# EAGLE design LooUQ CircuitRiver - Feather-630 Spring (EAGLE 7.5.0)
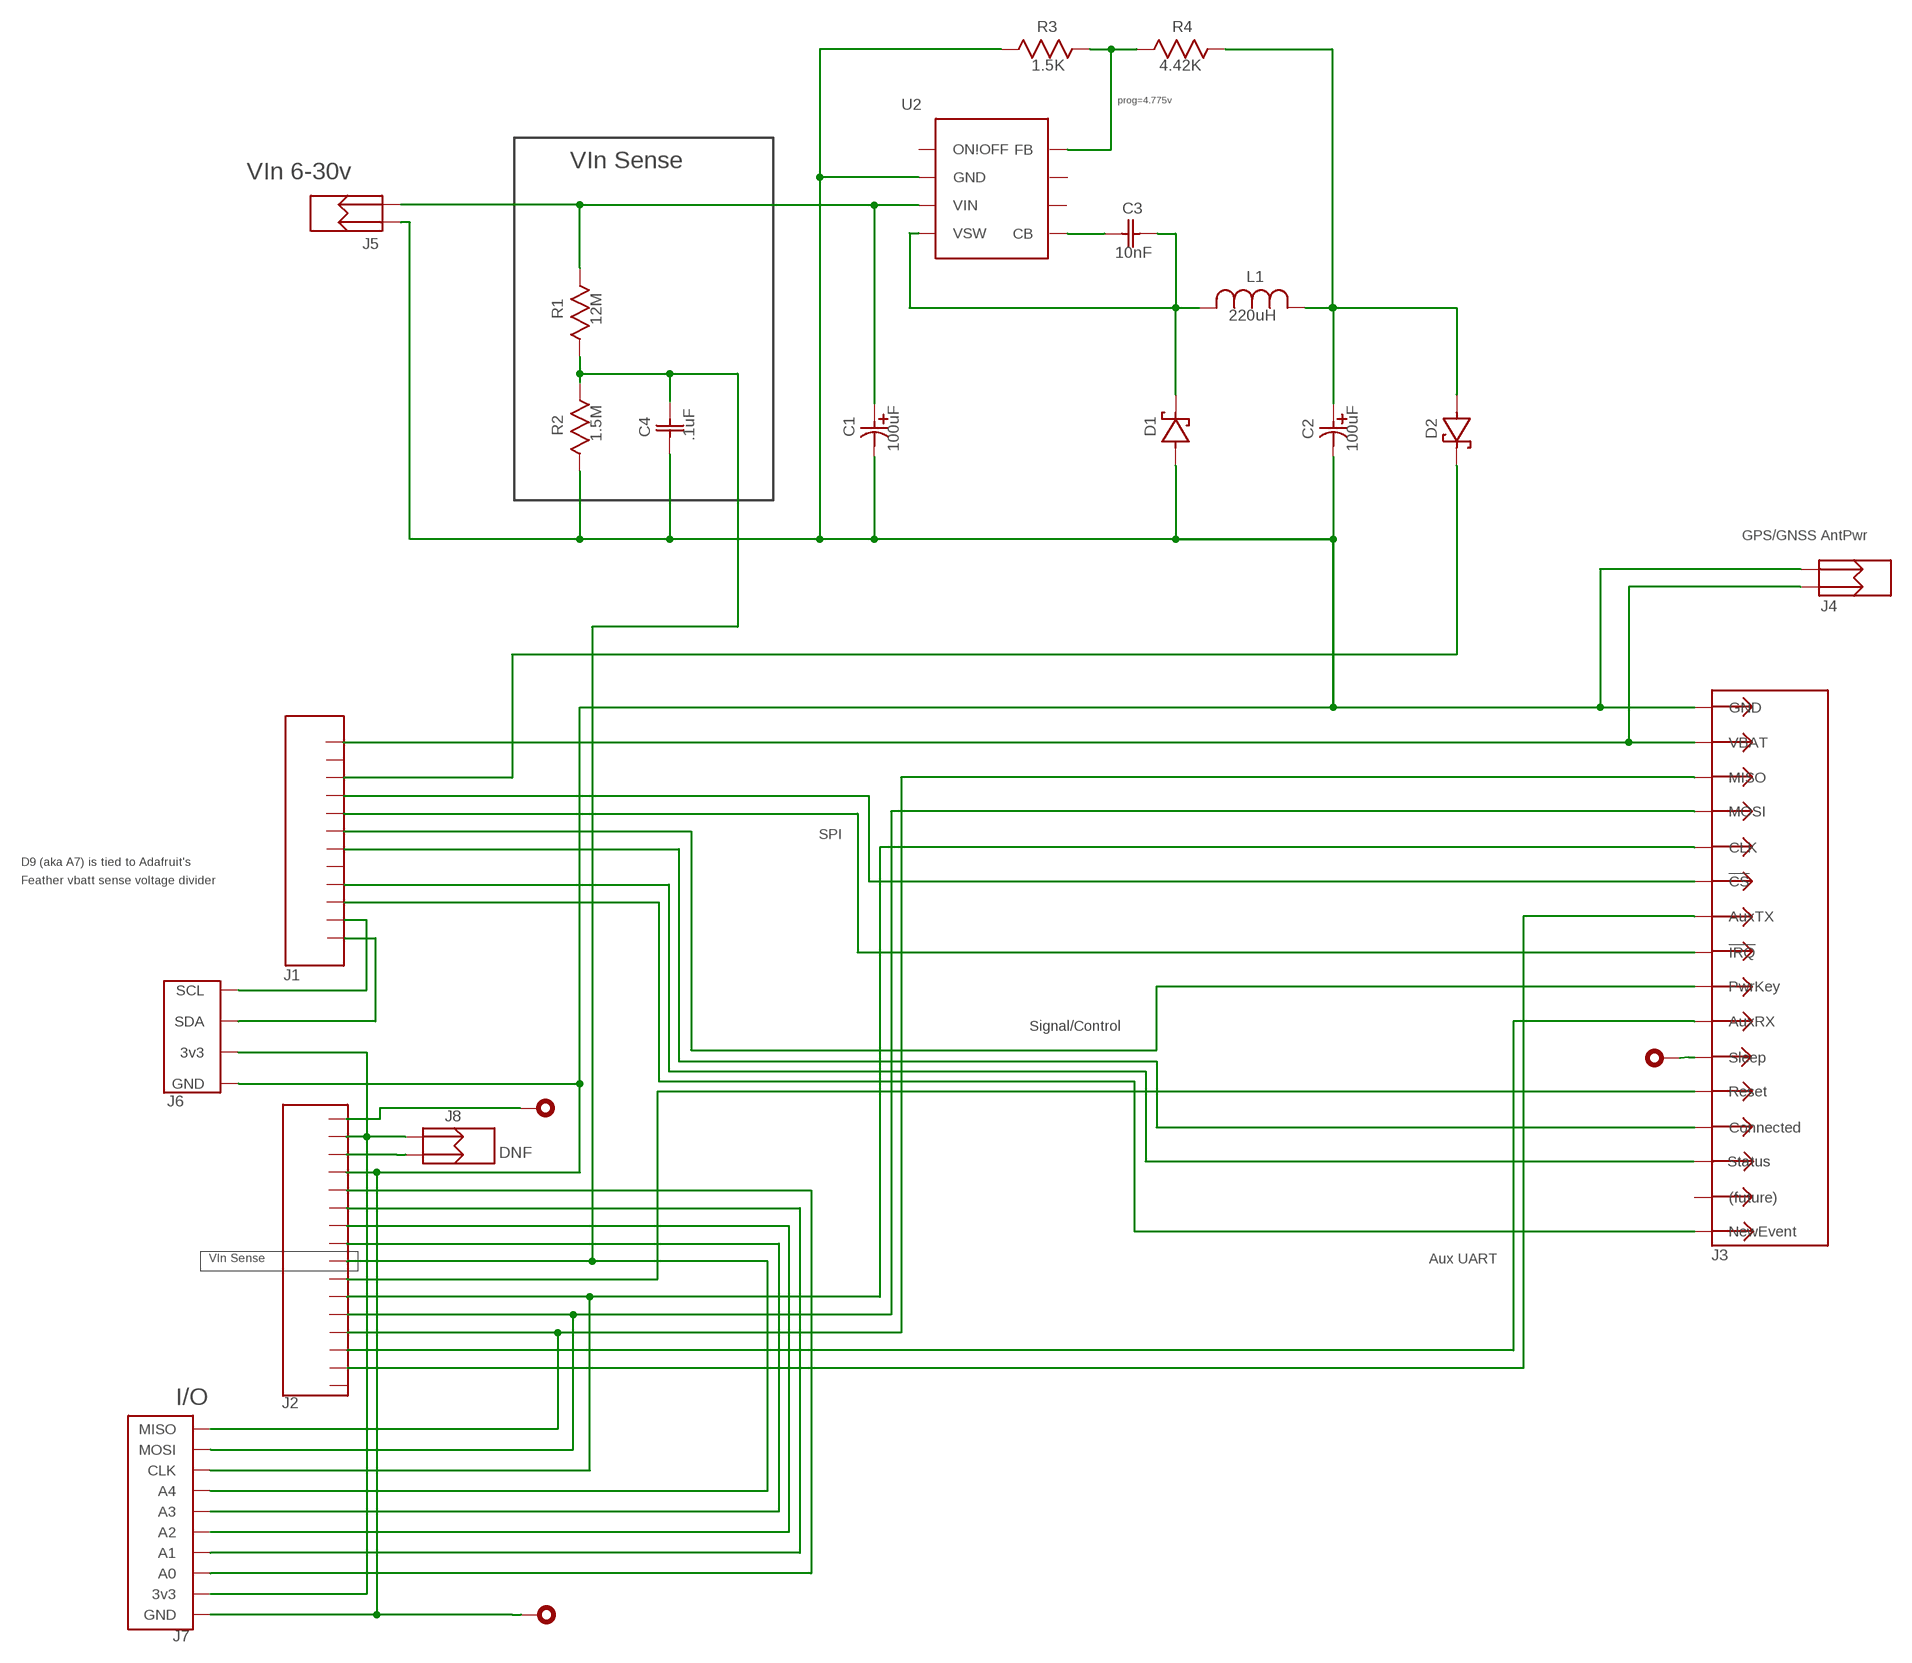
[diagram p0: schematic, sheet 1]

## Parts
C1  100uF  DEV_C1  [TC_2917]
C2  100uF  DEV_C2  [TC_2917]
C3  10nF  CAP_0603_NP  [CAP_0603]
C4  .1uF  CAP_0603_NP  [CAP_0603]
D1  1N5819HW  [SOD-123]
D2  1N5819HW  [SOD-123]
J1  FEATHERHOST-S  [HDR-1x12T/2.54/30x2]
J2  FEATHERHOST-L  [HDR-1x16T/2.54/40x2]
J3  CR-SPRING_HEADER  [HDR-2x8T/2x2/16x4]
J4  JST_PH-2_R/A_T/H  [JST_PH-2_R/A_T/H]
J5  JST_PH-2_VERT_T/H  [JST_PH-2_VERT_T/H]
J6  QWIIC_VERTICAL  [JST_SH-04_VERT_SMD_Qwiic]
J7  CR-RAPIDSIO_VERTICAL  [JST-SH_SMD-TopEntry_Rapids]
J8  DNF  2PIN_T/H_HEADER  [HDR-1x2T/2/4x2]
L1  220uH  INDUCTOR_-_BOURNS_SRR1260  [Bourns_SRR1260_Series]
LG1  DNF  LOOUQ_LOGO  [LooUQ-6mm]
LG2  DNF  CIRCUITRIVER_LOGO  [CircuitRiver-6mm]
P1  DNF  BREAKOUTPAD  [BreakoutConn]
P2  DNF  BREAKOUTPAD  [BreakoutConn]
P3  DNF  BREAKOUTPAD  [BreakoutConn]
R1  12M  RES_0603  [RES_0603]
R2  1.5M  RES_0603  [RES_0603]
R3  1.5K  1%_VPROG  [RES_0603]
R4  4.42K  1%_VPROG  [RES_0603]
U2  LM2674_BUCK  [SOIC-8/150mil]

## Nets
Net_1: J1.4(D13) J3.6(!CS)
Net_2: J2.4(MISO) J3.3(MISO) J7.10(MISO)
Net_3v3 [Power]: J2.15(+3V3) J6.2(3v3) J7.2(3v3) J8.2
Net_4: J1.6(D11) J3.9(PwrKey)
Net_5: J2.7(A5) J3.12(Reset)
Net_6: J2.6(SCK) J3.5(CLK) J7.8(CLK)
Net_7: J2.3(D0) J3.10(AuxRX)
Net_8: J2.5(MOSI) J3.4(MOSI) J7.9(MOSI)
Net_9: J1.7(D10) J3.13(Connected)
Net_10: R3.2 R4.1 U2.4(FB)
Net_11: J2.12(A0) J7.3(A0)
Net_12: J1.9(D6) J3.14(Status)
Net_14: J1.5(D12) J3.8(!IRQ)
Net_15: J2.10(A2) J7.5(A2)
Net_16: C3.1 U2.1(CB)
Net_18: C4.1 J2.8(A4) J7.7(A4) R1.1 R2.1
Net_19: J2.2(D1) J3.7(AuxTX)
Net_21 [Power]: C2.1(PLUS) D2.2(A) L1.2 R4.2
Net_22: J3.11(Sleep) P3.1
Net_23: J2.9(A3) J7.6(A3)
Net_25: J2.11(A1) J7.4(A1)
Net_26: J1.10(D5) J3.16(NewEvent)
Net_27: J1.12(SDA) J6.3(SDA)
Net_28: J1.11(SCI) J6.4(SCL)
Net_29: J2.14(AREF) J8.1
Net_30: J2.16(!RESET) P1.1
Net_GND [Power]: C1.2(MINUS) C2.2(MINUS) C4.2 D1.2(A) J2.13(GND) J3.1(GND) J4.2 J5.2 J6.1(GND) J7.1(GND) P2.1 R2.2 R3.1 U2.6(GND)
Net_VBAT [Power]: J1.1(VBAT) J3.2(VBAT) J4.1
Net_VBUS [Power]: D2.1(C) J1.3(VBUS)
Net_VIn [Power]: C1.1(PLUS) J5.1 R1.2 U2.7(VIN)
Net_VSW [Power]: C3.2 D1.1(C) L1.1 U2.8(VSW)
Unconnected: J1.2(EN) J1.8(D9) J2.1(GND) J3.15((future)) U2.2(NC) U2.3(NC) U2.5(ON\!OFF)

## Notes on the sheet
- prog=4.775v
- VIn Sense
- VIn 6-30v
- GPS/GNSS AntPwr
- SPI
- D9 (aka A7) is tied to Adafruit's
- Feather vbatt sense voltage divider
- Signal/Control
- VIn Sense | Aux UART
- I/O

## Library data of the parts
C1 = common:DEV_C1; MANUFACTURER: Kemet; MFGPARTNM: T491X107K025AT
C2 = common:DEV_C2; MANUFACTURER: Kemet; MFGPARTNM: T491X107K025AT
C3 = common:CAP_0603_NP; MANUFACTURER: AVX; MFGPARTNM: 06035C103KAT2A
C4 = common:CAP_0603_NP; MANUFACTURER: AVX; MFGPARTNM: 06035C103KAT2A; VALUE: 10nF
D1 D2 = common:1N5819HW; DATASHEET: http://datasheets.diptrace.com/diodes/ds30217.pdf; MANUFACTURER: Diodes; MFGPARTNM: 1N5819HW-7-F
J1 = common:FEATHERHOST-S; DATASHEET: https://drawings-pdf.s3.amazonaws.com/10492.pdf; DESCRIPTION: CONN HDR 12POS 0.1 TIN PCB; MANUFACTURER: Sullins; MFGPARTNM: PPTC121LFBN-RC
J2 = common:FEATHERHOST-L; DATASHEET: https://drawings-pdf.s3.amazonaws.com/10492.pdf; DESCRIPTION: CONN HDR 16POS 0.1 TIN PCB; MANUFACTURER: Sullins; MFGPARTNM: PPTC161LFBN-RC
J3 = common:CR-SPRING_HEADER; DATASHEET: https://cdn.harwin.com/pdfs/M22-204.pdf; MANUFACTURER: Harwin; MFGPARTNM: M22-2040805
J4 = common:JST_PH-2_R/A_T/H; DATASHEET: http://www.jst-mfg.com/product/pdf/eng/ePH.pdf; DESCRIPTION: CONN HEADER R/A 2POS 2MM; MANUFACTURER: JST; MFGPARTNM: S2B-PH-K-S(LF)(SN)
J5 = common:JST_PH-2_VERT_T/H; DATASHEET: http://www.jst-mfg.com/product/pdf/eng/ePH.pdf; DESCRIPTION: CONN HEADER R/A 2POS 2MM; MANUFACTURER: JST; MFGPARTNM: B2B-PH-K-S(LF)(SN)
J6 = common:QWIIC_VERTICAL; DESCRIPTION: CONN HEADER SMD 4POS 1MM; MANUFACTURER: JST; MFGPARTNM: BM04B-SRSS-TB(LF)(SN)
J7 = common:CR-RAPIDSIO_VERTICAL; DATASHEET: http://www.jst-mfg.com/product/pdf/eng/eSH.pdf; DESCRIPTION: CONN HEADER SMD 10POS 1MM; MANUFACTURER: JST; MFGPARTNM: BM10B-SRSS-TB(LF)(SN)
J8 = common:2PIN_T/H_HEADER; DATASHEET: https://media.digikey.com/pdf/Data%20Sheets/3M%20PDFs/951yyy-xx22-AR_Series%20Datasheet.pdf; MANUFACTURER: 3M; MFGPARTNM: 951102-8622-AR
L1 = common:INDUCTOR_-_BOURNS_SRR1260; DATASHEET: https://www.bourns.com/docs/Product-Datasheets/SRR1260.pdf; MANUFACTURER: Bourns; MFGPARTNM: SRR1260-221K
LG1 = common:LOOUQ_LOGO
LG2 = common:CIRCUITRIVER_LOGO
P1-P3 = common:BREAKOUTPAD
R1 = common:RES_0603; DESCRIPTION: RES 12M OHM 5% 1/10W 0603; MANUFACTURER: Stackpole; MFGPARTNM: RMCF0603JT12M0
R2 = common:RES_0603; DESCRIPTION: RES 12M OHM 5% 1/10W 0603; MANUFACTURER: Stackpole; MFGPARTNM: RMCF0603JT12M0; VALUE: 12M
R3 = common:1%_VPROG; DESCRIPTION: RES SMD 1.5K OHM 1% 1/20W 0201; MANUFACTURER: Yageo; MFGPARTNM: RC0201FR-071K5L
R4 = common:1%_VPROG; DESCRIPTION: RES SMD 1.5K OHM 1% 1/20W 0201; MANUFACTURER: Yageo; MFGPARTNM: RC0201FR-071K5L; VALUE: 1.5K
U2 = common:LM2674_BUCK; DESCRIPTION: IC REG BUCK 5V 0.5A 8SOIC; MANUFACTURER: TI; MFGPARTNM: LM2674MX-ADJ/NOPB

## Net classes
1 Power: width 0.5 mm, clearance 0.2 mm

## Board
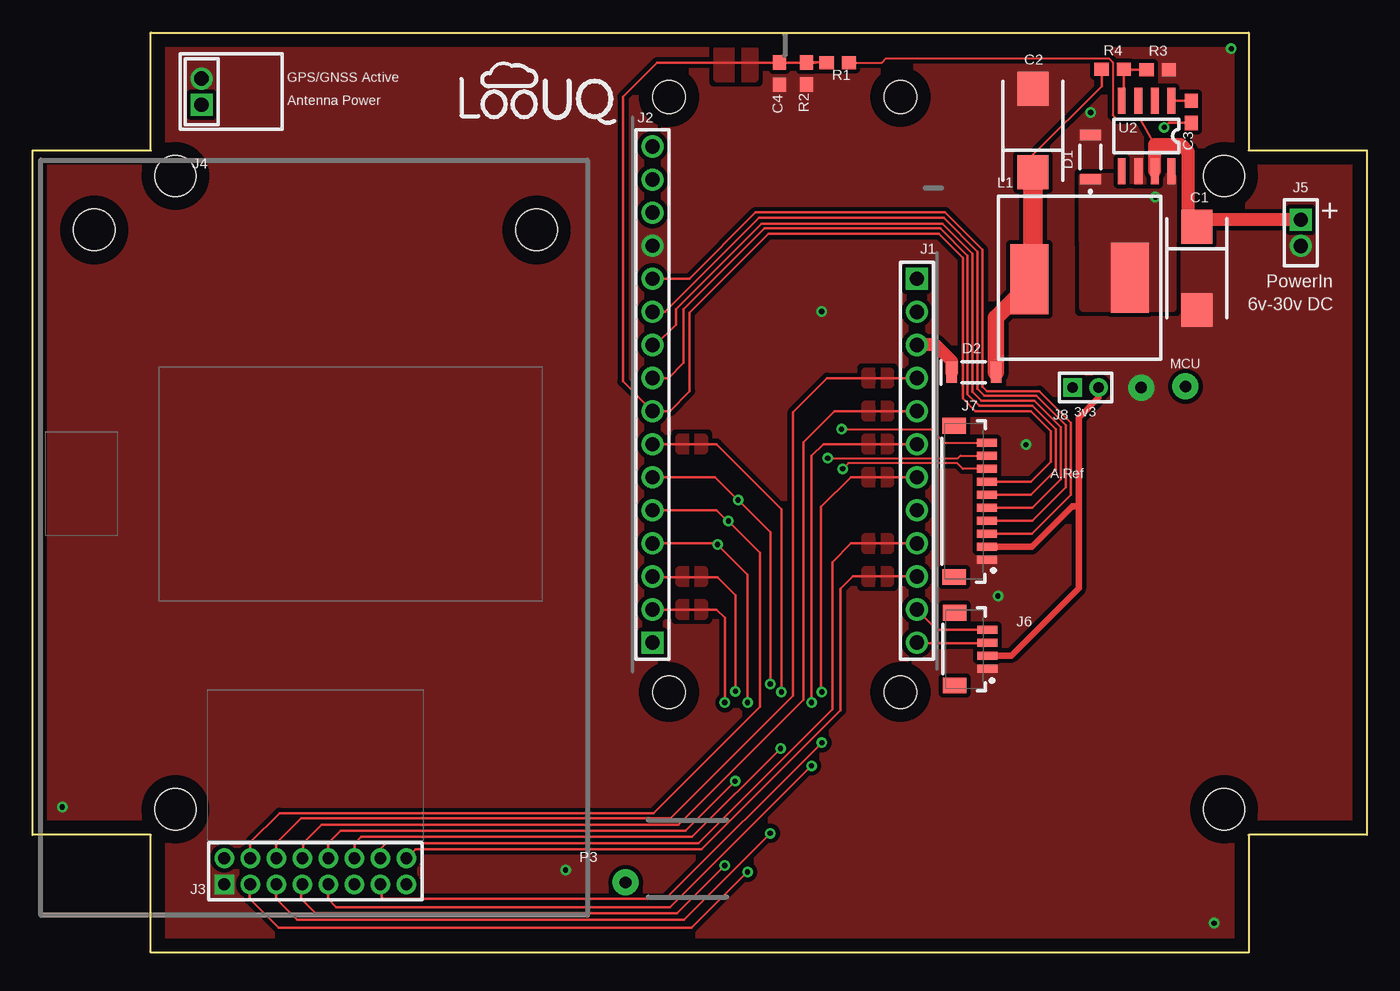
[diagram p1: board, top side]
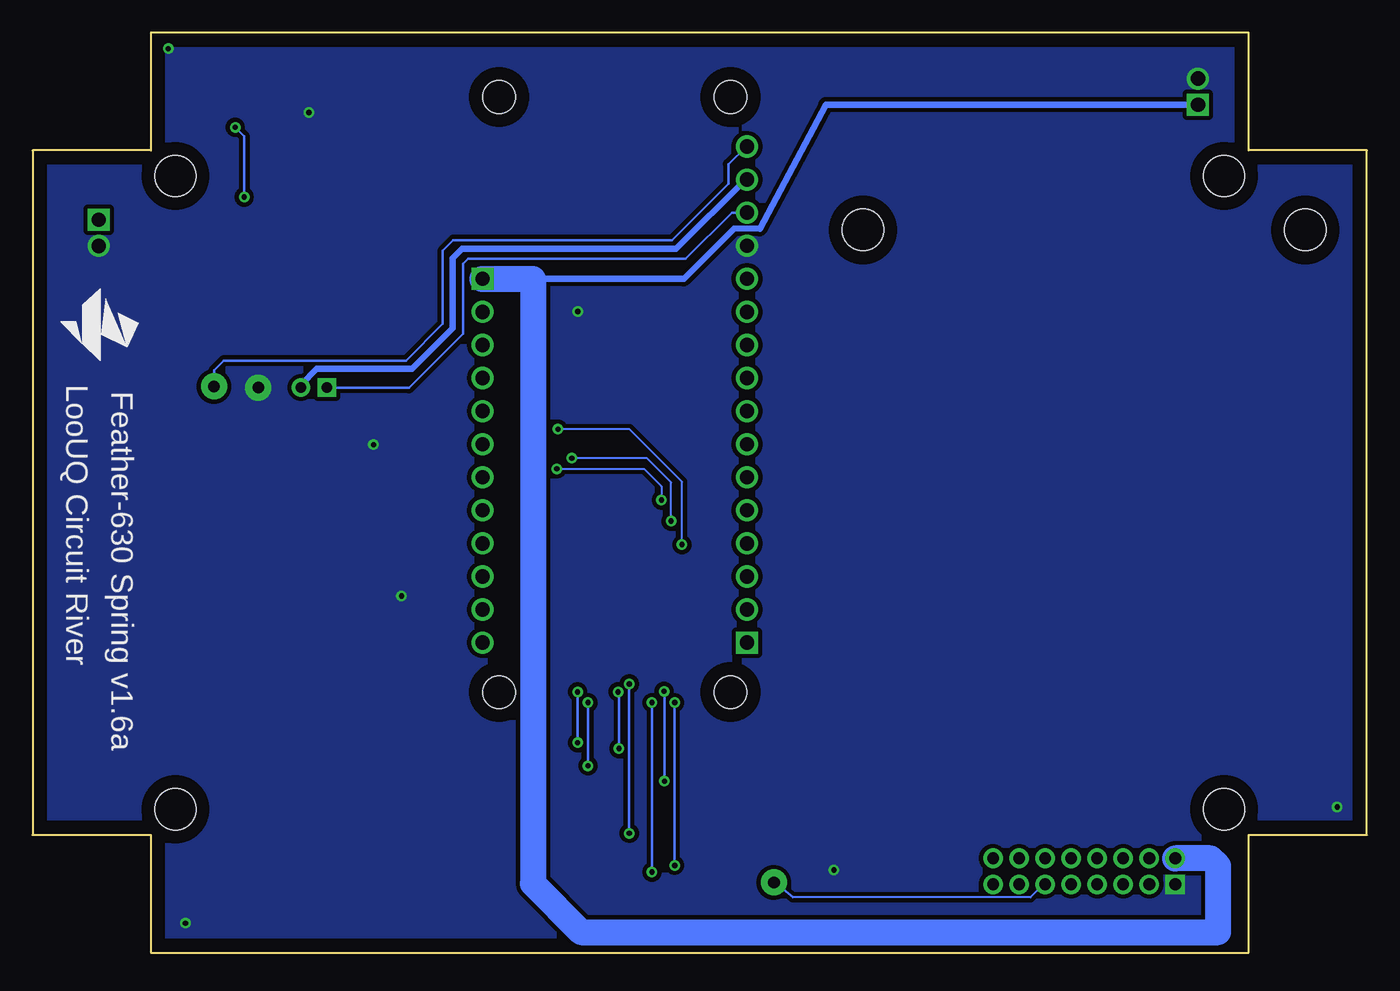
[diagram p2: board, bottom side, seen from below]

Size 102.51 x 70.66 mm. Coordinates in mm from the lower left corner, seen from the top.
Outline: 9.09,0 9.09,9.04 0,9.04 0,61.62 9.09,61.62 9.09,70.66 93.42,70.66 93.42,61.62 102.51,61.62 102.51,9.04 93.42,9.04 93.42,0 9.09,0
Copper layers (1*16): Top 0.035mm / dielectric 1.5mm / Bottom 0.035mm
Design rules "default *": minimum track width 10mil, minimum drill 0.61mm, track to track 8mil, track to pad 8mil, pad to pad 8mil, via to via 8mil, smd to smd 8mil, copper to edge 40mil, drill to drill 8mil, minimum pad ring 0mil, minimum via ring 8mil, stop-mask expansion 4mil, vias tented up to drill 16mil, thermal gap 10mil
Holes 3.17 mm at 10.97,59.65 91.54,11.01 91.54,59.65 10.97,11.01
Holes 2.54 mm at 66.67,65.72 48.9,65.72 66.67,20 48.9,20
Holes 3.2 mm at 4.72,55.5 38.73,55.5
tRestrict: 11 lines

### Footprints (pad centres in the part's own frame; a part is rotated, then mirrored left to right if it is on the bottom)
TC_2917 = smd 2.6 x 2.4: 1 -3.2,0; 2 3.2,0
CAP_0603 = smd 1.1 x 1: 1 -0.85,0; 2 0.85,0
SOD-123 = smd 0.8 x 1.6: 1 -1.7,0; 2 1.7,0
SOD-123_D2 = smd 0.8 x 1.6: 1 -1.7,0; 2 1.7,0
HDR-1x12T/2.54/30x2 = drill 1.1 pad 1.7 square: 1 -13.97,0 | drill 1.1 pad 1.7: 2 -11.43,0; 3 -8.89,0; 4 -6.35,0; 5 -3.81,0; 6 -1.27,0; 7 1.27,0; 8 3.81,0; 9 6.35,0; 10 8.89,0; 11 11.43,0; 12 13.97,0
HDR-1x16T/2.54/40x2 = drill 1.1 pad 1.7 square: 1 -19.05,0 | drill 1.1 pad 1.7: 2 -16.51,0; 3 -13.97,0; 4 -11.43,0; 5 -8.89,0; 6 -6.35,0; 7 -3.81,0; 8 -1.27,0; 9 1.27,0; 10 3.81,0; 11 6.35,0; 12 8.89,0; 13 11.43,0; 14 13.97,0; 15 16.51,0; 16 19.05,0
HDR-2x8T/2x2/16x4 = drill 0.9 pad 1.5 square: 1 -7,-1 | drill 0.9 pad 1.5: 2 -7,1; 3 -5,-1; 4 -5,1; 5 -3,-1; 6 -3,1; 7 -1,-1; 8 -1,1; 9 1,-1; 10 1,1; 11 3,-1; 12 3,1; 13 5,-1; 14 5,1; 15 7,-1; 16 7,1
JST_PH-2_R/A_T/H = drill 1.1 pad 1.7 square: 1 0,-1 | drill 1.1 pad 1.7: 2 0,1
JST_PH-2_VERT_T/H = drill 1.1 pad 1.7 square: 1 0,-1 | drill 1.1 pad 1.7: 2 0,1
JST_SH-04_VERT_SMD_Qwiic = smd 0.6 x 1.55: 1 -1.5,0; 2 -0.5,0; 3 0.5,0; 4 1.5,0 | smd 1.2 x 1.8: P1 -2.8,2.525; P2 2.8,2.525
JST-SH_SMD-TopEntry_Rapids = smd 0.6 x 1.55: 1 -4.5,0; 2 -3.5,0; 3 -2.5,0; 4 -1.5,0; 5 -0.5,0; 6 0.5,0; 7 1.5,0; 8 2.5,0; 9 3.5,0; 10 4.5,0 | smd 1.2 x 1.8: P1 -5.8,2.525; P2 5.8,2.525
HDR-1x2T/2/4x2 = drill 0.8 pad 1.4 square: 1 -1,0 | drill 0.8 pad 1.4: 2 1,0
Bourns_SRR1260_Series = smd 2.9 x 5.4: 1 -3.85,0; 2 3.85,0.117
BreakoutConn = drill 0.9 pad 2: 1 0,0
RES_0603 = smd 1.1 x 1: 1 -0.85,0; 2 0.85,0
SOIC-8/150mil = smd 2 x 0.6: 1 -2.7,1.905; 2 -2.7,0.635; 3 -2.7,-0.635; 4 -2.7,-1.905; 5 2.7,-1.905; 6 2.7,-0.635; 7 2.7,0.635; 8 2.7,1.905

### Placement (x,y rotation side)
C1  89.44,52.56 270 top
C2  76.86,63.14 90 top
C3  89.02,64.58 270 top
C4  57.36,67.51 270 top
D1  81.26,61.1 90 top
D2  1N5819HW  [SOD-123_D2]  72.31,44.57 0 top
J1  67.94,37.78 270 top
J2  47.62,42.86 90 top
J3  CR-SPRING HEADER  [HDR-2x8T/2x2/16x4]  21.73,6.25 0 top
J4  JST PH-2 R/A T/H  [JST_PH-2_R/A_T/H]  12.99,66.12 0 top
J5  JST PH-2 VERT T/H  [JST_PH-2_VERT_T/H]  97.43,55.28 180 top
J6  QWIIC VERTICAL  [JST_SH-04_VERT_SMD_Qwiic]  73.36,23.31 90 top
J7  CR-RAPIDSIO VERTICAL  [JST-SH_SMD-TopEntry_Rapids]  73.32,34.66 90 top
J8  80.9,43.4 0 top
L1  80.44,51.83 180 top
LG1  38.82,65.96 0 top
LG2  97.37,48.22 270 bottom
P1  88.57,43.49 90 top
P2  85.17,43.4 90 top
P3  45.56,5.4 90 top
R1  61.87,68.36 0 top
R2  59.45,67.53 270 top
R3  86.45,67.82 180 top
R4  82.99,67.85 180 top
U2  LM2674 BUCK  [SOIC-8/150mil]  85.58,62.72 270 top

### Tracks (layer width: path | path; a pad name or v marks a point on that pad's centre or on a via)
Net_1
  Top 0.2: J3.6 18.73,8.41 20.64,10.32 49.02,10.32 58.42,19.72 58.42,41.51 61.04,44.13 J1.4
  pour Top (isolate 0.15, no thermals): 63.98,44.61 63.98,43.66 65.88,43.66 65.88,44.61
Net_2  (via drill 0.4 pad 0.8)
  Top 0.15: v62.15,40.21 69.01,40.21 70.06,39.16 J7.10
  Top 0.2: J2.4 52.53,31.43 v52.62,31.34 54.93,29.04 v54.93,19.21 | v54.93,6.2 50.63,1.91 18.89,1.91 16.67,4.13 16.67,5.2 J3.3
  Bottom 0.15: v52.62,31.34 52.61,31.34 52.61,36.15 56.66,40.21 v62.15,40.21
  Bottom 0.2: v54.93,19.21 v54.93,6.2
Net_3v3
  Top 0.5: J8.2 81.9,42.62 80.36,41.09 80.36,34.27 | 80.36,34.27 80.36,27.99 75.19,22.81 J6.2 | J7.2 76.78,31.16 79.89,34.27 80.36,34.27
  Bottom 0.5: J2.15 47.74,59.37 53.07,54.04 69.53,54.04 70.25,53.32 70.25,47.94 73.35,44.83 80.67,44.83 81.9,43.61 J8.2
Net_4  (via drill 0.4 pad 0.8)
  Top 0.2: J1.6 60.76,39.05 59.85,38.14 v59.85,19.21 | v59.85,14.35 48.99,3.49 23.34,3.49 22.7,4.13 22.7,5.25 J3.9
  Bottom 0.2: v59.85,19.21 v59.85,14.35
  pour Top (isolate 0.15, no thermals): 63.98,39.53 63.98,38.58 65.88,38.58 65.88,39.53
Net_5  (via drill 0.4 pad 0.8)
  Top 0.2: J2.7 52.55,39.05 57.53,34.07 v57.53,20.03 | v57.47,15.68 50.68,8.89 25.24,8.89 24.73,8.37 J3.12
  Bottom 0.2: v57.53,20.03 57.47,20.03 v57.47,15.68
  pour Top (isolate 0.15, no thermals): 49.69,39.53 49.69,38.58 51.59,38.58 51.59,39.53
Net_6  (via drill 0.4 pad 0.8)
  Top 0.15: J7.8 71.47,37.16 71.04,37.6 62.67,37.6 v62.24,37.16
  Top 0.2: J3.5 18.73,4.13 20.32,2.54 50.05,2.54 v56.67,9.16 | v56.67,20.64 56.67,32.29 v54.2,34.77 54.18,34.75 52.41,36.51 J2.6
  Bottom 0.15: v62.24,37.16 55.54,37.16 54.2,35.82 v54.2,34.77
  Bottom 0.2: v56.67,9.16 v56.67,20.64
Net_7  (via drill 0.4 pad 0.8)
  Top 0.2: J2.3 47.62,28.84 52.6,28.84 54,27.44 v54,20.07 | v53.98,13.17 50.17,9.37 23.65,9.37 22.7,8.41 22.7,7.25 J3.10
  Bottom 0.2: v54,20.07 53.98,20.07 v53.98,13.17
  pour Top (isolate 0.15, no thermals): 49.69,29.37 49.69,28.42 51.59,28.42 51.59,29.37
Net_8  (via drill 0.4 pad 0.8)
  Top 0.15: v61.09,37.97 61.1,37.96 71.08,37.96 71.29,38.16 J7.9
  Top 0.2: J3.4 16.73,8.47 18.98,10.73 47.72,10.73 55.88,18.89 55.88,30.72 v53.46,33.15 53.41,33.1 52.55,33.97 J2.5
  Bottom 0.15: v53.46,33.15 53.46,36.11 55.31,37.97 v61.09,37.97
Net_9  (via drill 0.4 pad 0.8)
  Top 0.2: J3.13 26.82,5.25 26.82,4.3 26.99,4.13 48.64,4.13 v60.64,16.13 | v60.64,20.03 60.58,20.03 60.58,34.23 62.87,36.51 J1.7
  Bottom 0.2: v60.64,16.13 v60.64,20.03
  pour Top (isolate 0.15, no thermals): 63.98,36.99 63.98,36.04 65.88,36.04 65.88,36.99
Net_10
  Top 0.2: R3.2 83.87,67.81 R4.1 83.84,65.59 U2.4
Net_11
  Top 0.2: J2.12 50.46,51.75 55.56,56.85 70.1,56.85 72.98,53.97 72.98,43.48 73.32,43.13 77.33,43.13 79.77,40.69 79.77,35.17 76.76,32.16 J7.3
Net_12
  Top 0.2: J1.9 62.87,31.43 61.44,30 61.44,18.7 51.15,8.41 27.15,8.41 26.73,7.99 J3.14
  pour Top (isolate 0.15, no thermals): 63.98,31.91 63.98,30.96 65.88,30.96 65.88,31.91
Net_14
  Top 0.2: J1.5 61.59,41.59 59.21,39.21 59.21,19.42 49.63,9.84 22.23,9.84 20.8,8.41 20.8,7.25 J3.8
  pour Top (isolate 0.15, no thermals): 63.98,42.07 63.98,41.12 65.88,41.12 65.88,42.07
Net_15
  Top 0.2: J2.10 47.87,46.67 49.42,48.23 49.42,49.4 56.02,55.99 69.9,55.99 72.22,53.68 72.22,43.07 72.89,42.4 76.95,42.4 79.02,40.34 79.02,36.37 76.81,34.16 J7.5
Net_16
  Top 0.2: C3.1 U2.1
Net_18
  Top 0.2: R1.1 61.02,68.38 R2.1 60.14,68.38 60.16,68.36 C4.1 47.98,68.36 45.35,65.73 45.35,43.87 J2.8 48.96,41.59 50.49,43.12 50.49,49.13 56.56,55.2 69.61,55.2 71.45,53.36 71.45,42.56 72.43,41.59 76.69,41.59 78.22,40.06 78.22,37.7 76.69,36.16 J7.7 | J7.7
  pour Top (isolate 0.15, no thermals): 52.62,69.36 52.62,67.14 55.48,67.14 55.48,69.36
Net_19  (via drill 0.4 pad 0.8)
  Top 0.2: J3.7 20.63,5.25 20.63,4.13 21.75,3.02 49.49,3.02 v53.18,6.7 | v53.18,19.21 53.18,25.72 52.55,26.35 J2.2
  Bottom 0.2: v53.18,6.7 v53.18,19.21
  pour Top (isolate 0.15, no thermals): 49.69,26.83 49.69,25.88 51.59,25.88 51.59,26.83
Net_21
  Top 0.2: R4.2 82.14,66.55 76.86,61.27 C2.1
  Top 1.25: L1.2 76.59,51.34 74.01,48.77 D2.2
  Top 1.5: C2.1 76.86,51.98 L1.2
Net_22
  Bottom 0.15: J3.11 24.86,5.25 25.86,4.26 44.1,4.26 P3.1
Net_23
  Top 0.2: J7.6 76.69,35.16 78.63,37.1 78.63,40.19 76.82,42 72.73,42 71.83,42.9 71.83,53.53 69.73,55.63 56.24,55.63 50.01,49.4 50.01,45.3 48.84,44.13 J2.9
  Bottom 0.2: 47.7,44.2 J2.9
Net_25
  Top 0.2: J2.11 48.6,49.21 55.82,56.43 70.01,56.43 72.59,53.84 72.59,43.3 73.12,42.78 77.13,42.78 79.4,40.51 79.4,35.75 76.82,33.16 J7.4
Net_26
  Top 0.2: J1.10 63.02,28.89 62.07,27.94 62.07,18.61 51.4,7.94 29.41,7.94 J3.16
  pour Top (isolate 0.15, no thermals): 63.98,29.37 63.98,28.42 65.88,28.42 65.88,29.37
Net_27
  Top 0.2: J1.12 67.94,23.76 73.36,23.76 J6.3
Net_28
  Top 0.2: J1.11 69.49,24.81 J6.4
Net_29
  Bottom 0.2: J2.14 48.8,56.83 52.35,53.28 69.06,53.28 69.43,52.91 69.43,47.52 73.59,43.37 79.9,43.37 J8.1
Net_30
  Bottom 0.2: J2.16 49.05,60.56 49.05,59.06 53.39,54.73 70.19,54.73 71.01,53.91 71.01,48.28 73.82,45.47 87.82,45.47 88.57,44.72 P1.1
Net_GND  (via drill 0.4 pad 0.8)
  other vias: 92.09,69.43 74.17,27.4 40.96,6.35 81.29,64.52 2.29,11.19 60.62,49.24 90.77,2.27 76.32,39.01
  pour Bottom (isolate 0.33, no thermals): 9.84,69.85 92.39,69.85 92.39,60.96 92.42,60.84 92.49,60.74 92.59,60.67 92.71,60.64 101.6,60.64 101.6,9.84 92.39,9.84 92.27,9.82 92.17,9.75 92.1,9.65 92.08,9.53 92.08,0.95 10.16,0.95 10.16,9.84 10.14,9.96 10.07,10.07 9.96,10.14 9.84,10.16 0.95,10.16 0.95,60.33 9.53,60.33 9.65,60.35 9.75,60.42 9.82,60.52 9.84,60.64
  pour Top (isolate 0.33, rank 9): 9.84,69.85 92.39,69.85 92.39,60.96 92.42,60.84 92.49,60.74 92.59,60.67 92.71,60.64 101.6,60.64 101.6,9.84 92.39,9.84 92.27,9.82 92.17,9.75 92.1,9.65 92.08,9.53 92.08,0.95 10.16,0.95 10.16,9.84 10.14,9.96 10.07,10.07 9.96,10.14 9.84,10.16 0.95,10.16 0.95,60.33 9.53,60.33 9.65,60.35 9.75,60.42 9.82,60.52 9.84,60.64
Net_VBAT
  Bottom 0.45: 46.63,55.59 48.64,55.59
  Bottom 0.5: J4.1 41.57,65.12 46.63,55.59 | 48.64,55.59 52.48,51.75 J1.1
  Bottom 2: J1.1 64.08,51.75 64.08,5.3 60.37,1.59 11.43,1.59 11.43,6.67 12.02,7.25 J3.2
Net_VBUS
  Top 1: D2.1 70.61,45.42 69.36,46.67 J1.3
Net_VIn
  Top 0.15: R1.2 65.24,68.36 65.57,68.68 82.68,68.68 82.99,68.37 82.99,64.33 83.27,64.05 85.05,64.05 86.17,62.07 86.21,62.07
  Top 1: J5.1 89.96,56.28 C1.1 88.77,55.76 88.77,61.51 88.21,62.07 86.21,62.07 U2.7
Net_VSW  (via drill 0.4 pad 0.8)
  Top 0.2: C3.2 87.28,63.73 v86.94,63.38
  Bottom 0.2: v86.94,63.38 86.25,62.69 v86.25,58.04
  pour Top (isolate 0.33, no thermals): 80.69,59.59 87.61,59.56 87.57,49.47 80.73,49.51

### Text on the board
tPlace: GPS/GNSS Active | Antenna Power | + | PowerIn | 6v-30v DC | MCU | 3v3 | A.Ref
bPlace: LooUQ Circuit River | Feather-630 Spring v1.6a
tDocu: USB (ctr) | F.Batt | Feather Long Header | LTEm1 USB | LTEm1 SIM | F.Ext 55.5 | Connector | Keepout | F.RF 61.46 | Designed for Polycase LP-35